# EAGLE design Shield V1.0 (EAGLE 8.2.1)
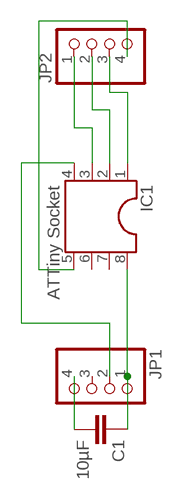
[diagram p0: schematic, sheet 1]

## Parts
C1  10µF  C2,5-3  [C2.5-3]
IC1  ATTiny Socket  DIL8S  [SOCKET-08]
JP1  PINHD-1X4  [1X04]
JP2  PINHD-1X4  [1X04]

## Nets
N$1: IC1.3 JP2.1
N$2: IC1.2 JP2.2
N$3: IC1.1 JP2.3
N$4: IC1.5 JP2.4
N$5: IC1.4 JP1.2
N$6: C1.2 JP1.4
N$7: C1.1 IC1.8 JP1.1
Unconnected: IC1.6 IC1.7 JP1.3

## Library data of the parts
C1 = capacitor-wima:C: CAPACITOR naming: grid - package width
IC1 = ic-package:DIL8: Dual In Line / Socket
JP1 JP2 = pinhead:PINHD-1X4: PIN HEADER

## Board
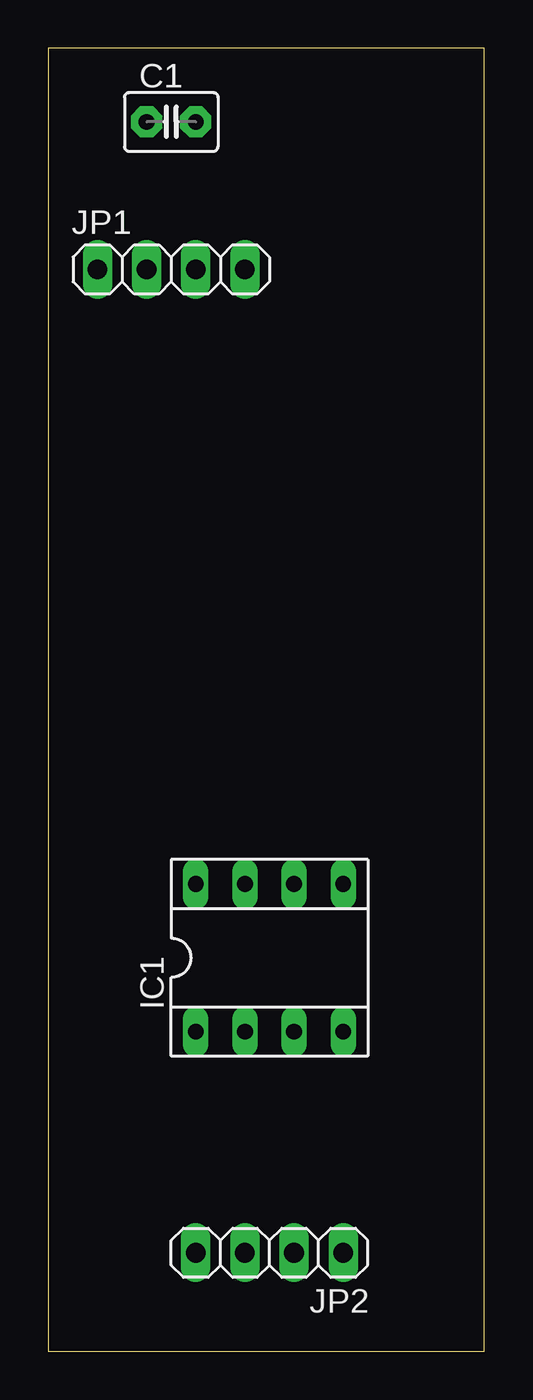
[diagram p1: board, top side]
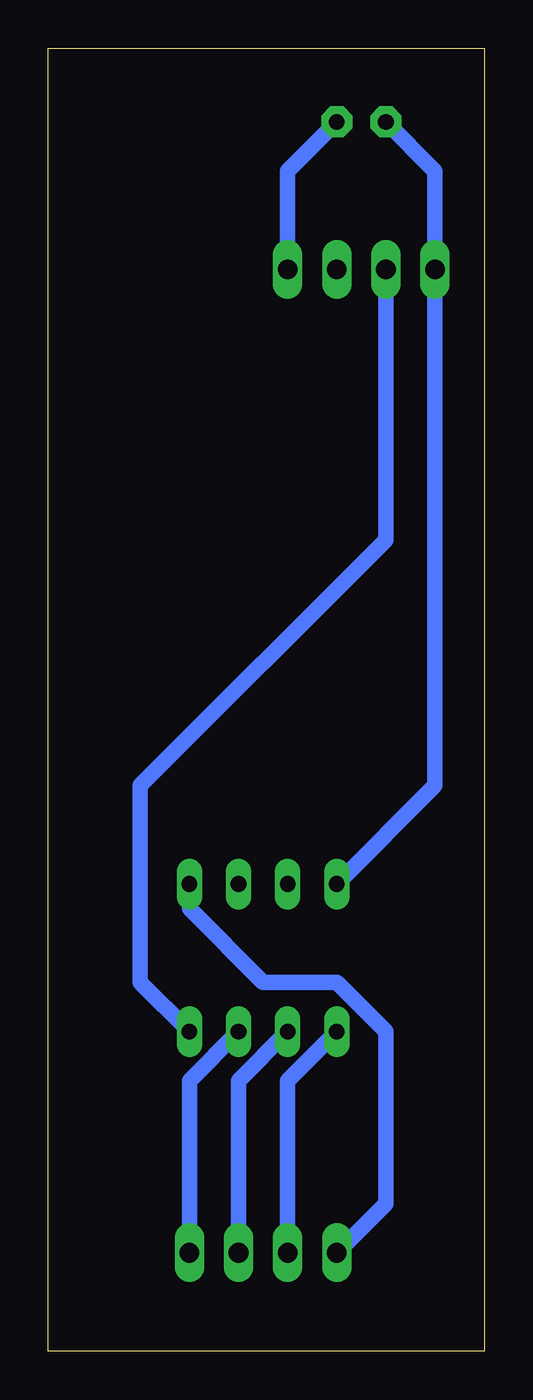
[diagram p2: board, bottom side, seen from below]

Size 22.53 x 67.3 mm. Coordinates in mm from the lower left corner, seen from the top.
Outline: 0,0 22.53,0 22.53,67.3 0,67.3 0,0
Copper layers (1*16): Top 0.035mm / dielectric 1.5mm / Bottom 0.035mm
Design rules "default": minimum track width 10mil, minimum drill 24mil, track to track 8mil, track to pad 8mil, pad to pad 8mil, via to via 8mil, smd to smd 8mil, copper to edge 40mil, drill to drill 8mil, minimum pad ring 10mil, minimum via ring 8mil, stop-mask expansion 4mil, vias tented up to drill 0mil, thermal gap 10mil

### Footprints (pad centres in the part's own frame; a part is rotated, then mirrored left to right if it is on the bottom)
C2.5-3 = drill 0.813 pad 1.6 octagon: 1 -1.27,0; 2 1.27,0
SOCKET-08 = drill 0.813 long: 1 -3.81,-3.81; 2 -1.27,-3.81; 3 1.27,-3.81; 4 3.81,-3.81; 5 3.81,3.81; 6 1.27,3.81; 7 -1.27,3.81; 8 -3.81,3.81
1X04 = drill 1.016 long: 1 -3.81,0; 2 -1.27,0; 3 1.27,0; 4 3.81,0

### Placement (x,y rotation side)
C1  [C2.5-3]  6.35,63.5 0 top
IC1  [SOCKET-08]  11.43,20.32 0 top
JP1  6.35,55.88 0 top
JP2  11.43,5.08 180 top

### Tracks (layer width: path | path; a pad name or v marks a point on that pad's centre or on a via)
N$1
  Bottom 0.813: IC1.3 15.24,13.97 JP2.1
N$2
  Bottom 0.813: IC1.2 12.7,13.97 JP2.2
N$3
  Bottom 0.813: IC1.1 10.16,13.97 JP2.3
N$4
  Bottom 0.406: IC1.5 15.24,22.86
  Bottom 0.813: 15.24,22.86 11.43,19.05 7.62,19.05 5.08,16.51 5.08,7.62 JP2.4
N$5
  Bottom 0.813: JP1.2 5.08,41.91 17.78,29.21 17.78,19.05 IC1.4
N$6
  Bottom 0.813: C1.2 10.16,60.96 JP1.4
N$7
  Bottom 0.813: C1.1 2.54,60.96 JP1.1 2.54,29.21 IC1.8